# Altium schematic sheet Oscilloscope.SchDoc
size A4
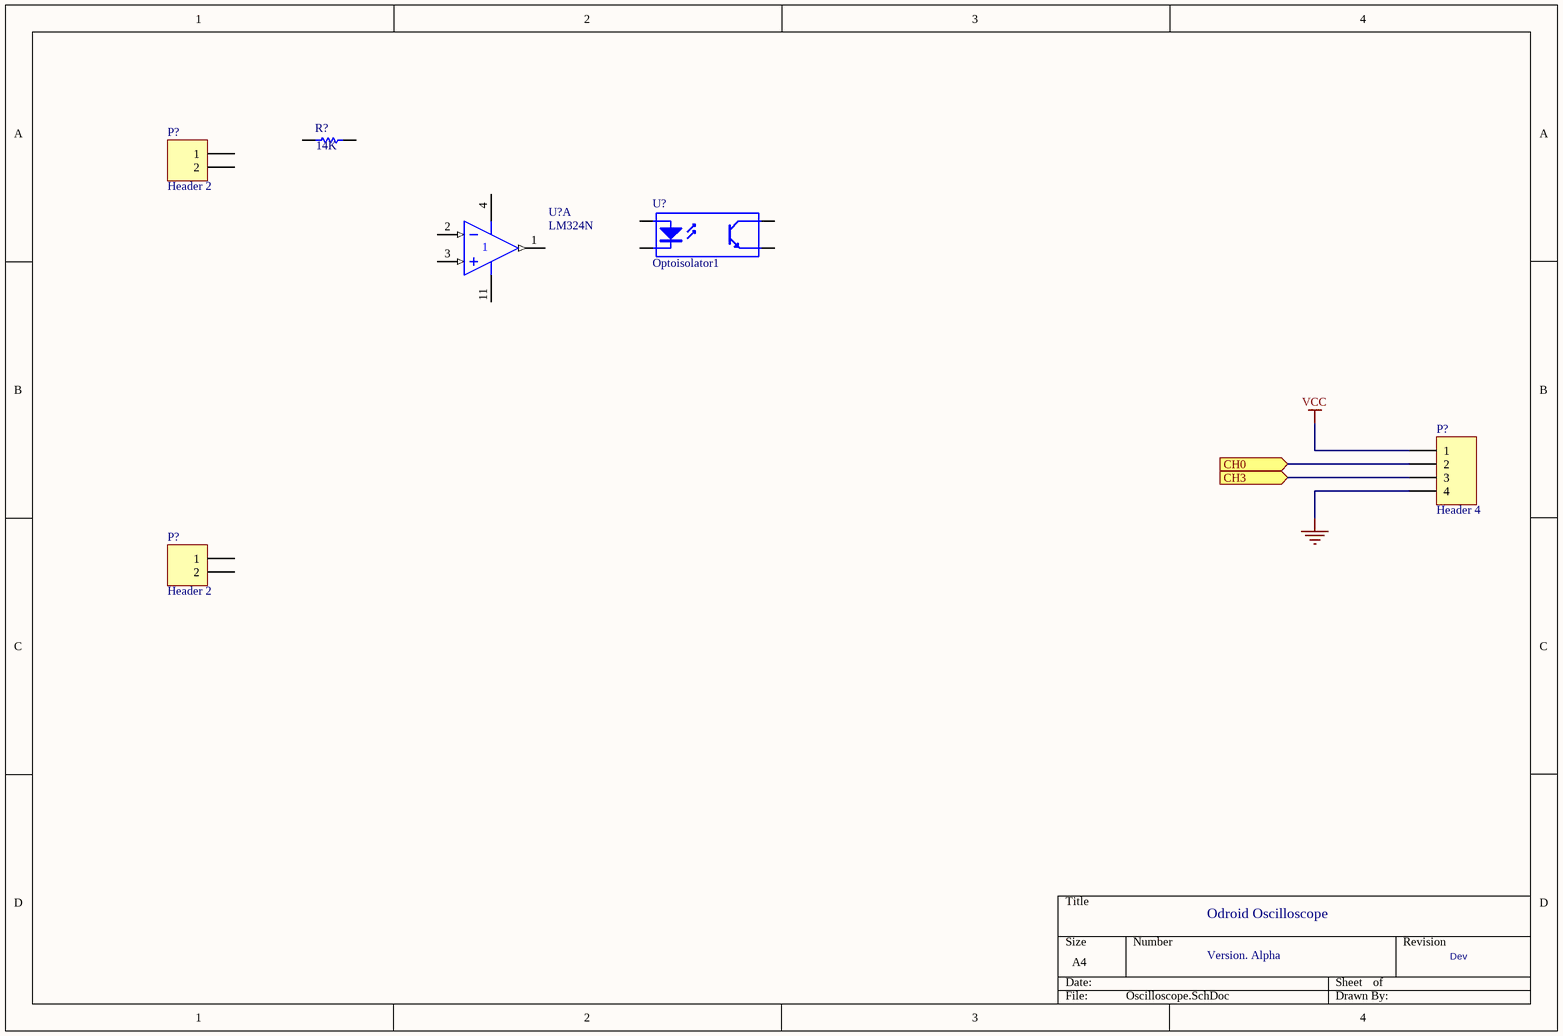
[diagram p0: Oscilloscope.SchDoc]

## Parts
(Parts that share a designator on the sheet are numbered #1, #2 ... from top to bottom, then left to right.)
P?#1  Header 2  [HDR1X2]
P?#2  Header 4  [HDR1X4]
P?#3  Header 2  [HDR1X2]
R?  value 14K  [AXIAL-0.3]  (hidden comment: Res1)
U?#1  Optoisolator1  [DIP-4]
U?#2  LM324N  [646-06]  (part A of 4)

## Ports
CH0, CH3

## Nets
GND: P?#2.4
VCC: P?#2.1
CH0: P?#2.2 ; port CH0
CH3: P?#2.3 ; port CH3

Not connected (* = marked no-connect by the designer): P?#1 1 2; P?#3 1 2; R? 1 2; U?#1 1(A) 2(K) 3(E) 4(C); U?#2 1(OUT) 2(IN-) 3(IN+) 4(V+) 11(V-)

## Notes on the sheet
- Odroid Oscilloscope
- Version. Alpha
- Dev

## Library data of the parts
P?#1 P?#3 = Header 2: Header, 2-Pin; LatestRevisionDate: 17-Jul-2002; LatestRevisionNote: Re-released for DXP Platform.; Publisher: Altium Limited
P?#2 = Header 4: Header, 4-Pin; LatestRevisionDate: 17-Jul-2002; LatestRevisionNote: Re-released for DXP Platform.; Publisher: Altium Limited
R? = Res1: Resistor; Published: 8-Jun-2000; LatestRevisionDate: 17-Jul-2002; LatestRevisionNote: Re-released for DXP Platform.; PackageReference: AXIAL-0.3; Publisher: Altium Limited; PackageDescription: Axial Device, Thru-Hole; 2 Leads; 0.3 in Pin Spacing
U?#1 = Optoisolator1: 4-Pin Phototransistor Optocoupler; Published: 24-Mar-1999; LatestRevisionDate: 04-Mar-2005; LatestRevisionNote: Sch pins 3 & 4 Swapped.; DatasheetVersion: Nov-2003; PackageReference: DIP-4; Publisher: Altium Limited
U?#2 = LM324N: Quad Low-Power Operational Amplifier; Published: 17-Jul-2002; LatestRevisionDate: 06-Jun-2005; LatestRevisionNote: Stylized 3D Model Added.; DatasheetVersion: 1988; PackageVersion: 1997; PackageReference: 646-06; Publisher: Altium Limited; PackageDescription: DIP; 14 Leads; Row Spacing 7.62 mm; Pitch 2.54 mm; ComponentLink1Description: Manufacturer Link; ComponentLink1URL: http://www.onsemi.com/site/products/parametrics/0,4446,251,00.html; ComponentLink2Description: Datasheet; ComponentLink2URL: http://www.onsemi.com/pub/Collateral/LM324-D.PDF